# EAGLE design MotorSteuerung (EAGLE 9.4.2)
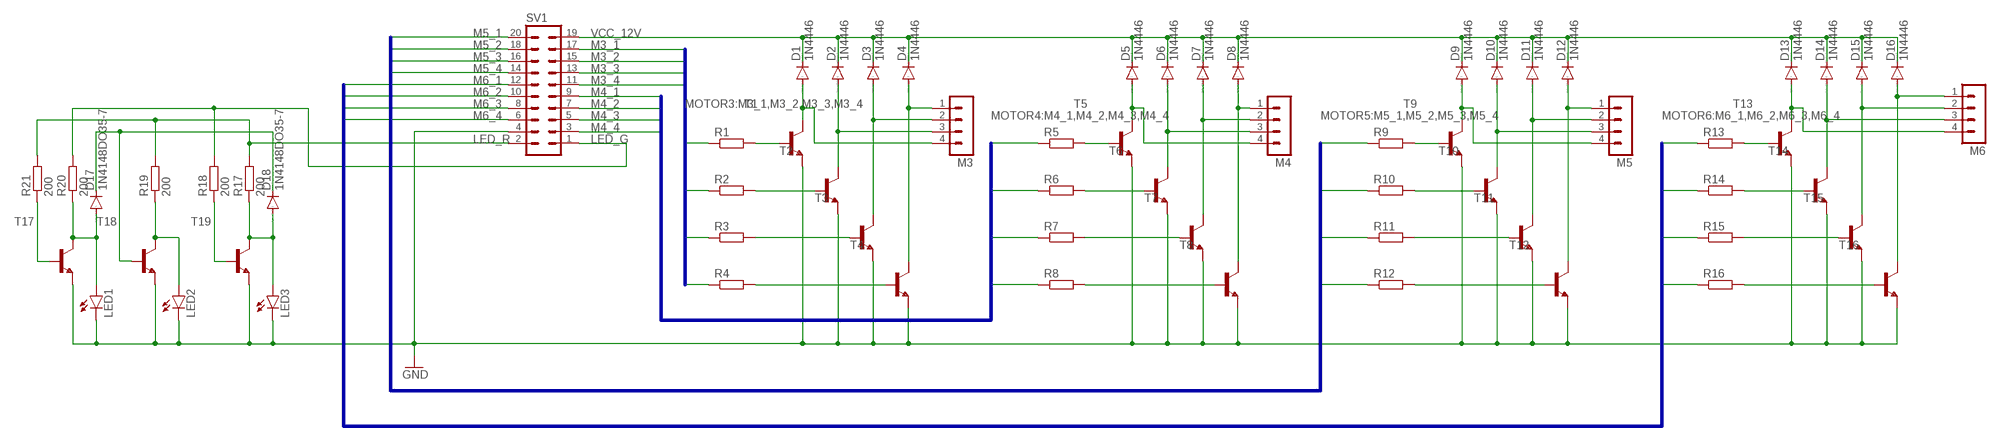
[diagram p0: schematic, sheet 1]

## Parts
D1  1N4446  [DO35-10]
D2  1N4446  [DO35-10]
D3  1N4446  [DO35-10]
D4  1N4446  [DO35-10]
D5  1N4446  [DO35-10]
D6  1N4446  [DO35-10]
D7  1N4446  [DO35-10]
D8  1N4446  [DO35-10]
D9  1N4446  [DO35-10]
D10  1N4446  [DO35-10]
D11  1N4446  [DO35-10]
D12  1N4446  [DO35-10]
D13  1N4446  [DO35-10]
D14  1N4446  [DO35-10]
D15  1N4446  [DO35-10]
D16  1N4446  [DO35-10]
D17  1N4148DO35-7  [DO35-7]
D18  1N4148DO35-7  [DO35-7]
LED1  LED3MM  [LED3MM]
LED2  LED3MM  [LED3MM]
LED3  LED3MM  [LED3MM]
M3  MA04-1  [MA04-1]
M4  MA04-1  [MA04-1]
M5  MA04-1  [MA04-1]
M6  MA04-1  [MA04-1]
R1  R-EU_0207/10  [0207/10]
R2  R-EU_0207/10  [0207/10]
R3  R-EU_0207/10  [0207/10]
R4  R-EU_0207/10  [0207/10]
R5  R-EU_0207/10  [0207/10]
R6  R-EU_0207/10  [0207/10]
R7  R-EU_0207/10  [0207/10]
R8  R-EU_0207/10  [0207/10]
R9  R-EU_0207/10  [0207/10]
R10  R-EU_0207/10  [0207/10]
R11  R-EU_0207/10  [0207/10]
R12  R-EU_0207/10  [0207/10]
R13  R-EU_0207/10  [0207/10]
R14  R-EU_0207/10  [0207/10]
R15  R-EU_0207/10  [0207/10]
R16  R-EU_0207/10  [0207/10]
R17  200  R-EU_0207/10  [0207/10]
R18  200  R-EU_0207/10  [0207/10]
R19  200  R-EU_0207/10  [0207/10]
R20  200  R-EU_0207/10  [0207/10]
R21  200  R-EU_0207/10  [0207/10]
SV1  MA10-2  [MA10-2]
T1  -NPN-TO126V  [TO126V]
T2  -NPN-TO126V  [TO126V]
T3  -NPN-TO126V  [TO126V]
T4  -NPN-TO126V  [TO126V]
T5  -NPN-TO126V  [TO126V]
T6  -NPN-TO126V  [TO126V]
T7  -NPN-TO126V  [TO126V]
T8  -NPN-TO126V  [TO126V]
T9  -NPN-TO126V  [TO126V]
T10  -NPN-TO126V  [TO126V]
T11  -NPN-TO126V  [TO126V]
T12  -NPN-TO126V  [TO126V]
T13  -NPN-TO126V  [TO126V]
T14  -NPN-TO126V  [TO126V]
T15  -NPN-TO126V  [TO126V]
T16  -NPN-TO126V  [TO126V]
T17  -NPN-TO92  [TO92]
T18  -NPN-TO92  [TO92]
T19  -NPN-TO92  [TO92]

## Nets
GND: LED1.K(C) LED2.K(C) LED3.K(C) SV1.4 T1.1(E) T2.1(E) T3.1(E) T4.1(E) T5.1(E) T6.1(E) T7.1(E) T8.1(E) T9.1(E) T10.1(E) T11.1(E) T12.1(E) T13.1(E) T14.1(E) T15.1(E) T16.1(E) T17.1(E) T18.1(E) T19.1(E)
LED_G: R18.2 R20.2 SV1.1
LED_R: R17.2 R19.2 R21.2 SV1.2
M3_1: R1.1 SV1.17
M3_2: R2.1 SV1.15
M3_3: R3.1 SV1.13
M3_4: R4.1 SV1.11
M4_1: R5.1 SV1.9
M4_2: R6.1 SV1.7
M4_3: R7.1 SV1.5
M4_4: R8.1 SV1.3
M5_1: R9.1 SV1.20
M5_2: R10.1 SV1.18
M5_3: R11.1 SV1.16
M5_4: R12.1 SV1.14
M6_1: R13.1 SV1.12
M6_2: R14.1 SV1.10
M6_3: R15.1 SV1.8
M6_4: R16.1 SV1.6
N$1: D1.A M3.4 T1.2(C)
N$2: D2.A M3.3 T2.2(C)
N$3: D3.A M3.2 T3.2(C)
N$4: D4.A M3.1 T4.2(C)
N$5: R1.2 T1.3(B)
N$6: R2.2 T2.3(B)
N$7: R3.2 T3.3(B)
N$8: R4.2 T4.3(B)
N$9: D5.A M4.4 T5.2(C)
N$10: D6.A M4.3 T6.2(C)
N$11: D7.A M4.2 T7.2(C)
N$12: D8.A M4.1 T8.2(C)
N$13: R5.2 T5.3(B)
N$14: R6.2 T6.3(B)
N$15: R7.2 T7.3(B)
N$16: R8.2 T8.3(B)
N$17: D9.A M5.4 T9.2(C)
N$18: D10.A M5.3 T10.2(C)
N$19: D11.A M5.2 T11.2(C)
N$20: D12.A M5.1 T12.2(C)
N$21: R9.2 T9.3(B)
N$22: R10.2 T10.3(B)
N$23: R11.2 T11.3(B)
N$24: R12.2 T12.3(B)
N$25: D13.A M6.4 T13.2(C)
N$26: D14.A M6.3 T14.2(C)
N$27: D15.A M6.2 T15.2(C)
N$28: D16.A M6.1 T16.2(C)
N$29: R13.2 T13.3(B)
N$30: R14.2 T14.3(B)
N$31: R15.2 T15.3(B)
N$32: R16.2 T16.3(B)
N$33: D18.A LED3.A R17.1 T19.3(C)
N$34: LED2.A R19.1 T18.3(C)
N$35: D17.A LED1.A R20.1 T17.3(C)
N$36: D17.C D18.C T18.2(B)
N$38: R21.1 T17.2(B)
N$39: R18.1 T19.2(B)
VCC_12V: D1.C D2.C D3.C D4.C D5.C D6.C D7.C D8.C D9.C D10.C D11.C D12.C D13.C D14.C D15.C D16.C SV1.19

## Buses
MOTOR3:M3_1,M3_2,M3_3,M3_4
MOTOR4:M4_1,M4_2,M4_3,M4_4
MOTOR5:M5_1,M5_2,M5_3,M5_4
MOTOR6:M6_1,M6_2,M6_3,M6_4

## Library data of the parts
D1-D16 = diode:1N4446: DIODE high speed (Philips)
D17 D18 = diode:1N4148: DIODE high speed (Philips)
LED1-LED3 = led:LED: LED OSRAM: - CHIPLED LG R971, LG N971, LY N971, LG Q971, LY Q971, LO R971, LY R971 LH N974, LH R974 LS Q976, LO Q976, LY Q976 LO Q996 - Hyper CHIPLED LW Q18S LB Q993, LB Q99A, LB R99A - SideLED LS A670, LO A670, LY A670, LG A670, LP A670 LB A673, LV A673, LT A673, LW A673 LH A674 LY A675 LS A676, LA A676, LO A676, LY A676, LW A676 LS A679, LY A679, LG A679 - Hyper Micro SIDELED® LS Y876, LA Y876, LO Y876, LY Y876 LT Y87S - SmartLED LW L88C, LW L88S LB L89C, LB L89S, LG L890 LS L89K, LO L89K, LY L89K LS L896, LA L896, LO L896, LY L896 - TOPLED LS T670, LO T670, LY T670, LG T670, LP T670 LSG T670, LSP T670, LSY T670, LOP T670, LYG T670 LG T671, LOG T671, LSG T671 LB T673, LV T673, LT T673, LW T673 LH T674 LS T676, LA T676, LO T676, LY T676, LB T676, LH T676, LSB T676, LW T676 LB T67C, LV T67C, LT T67C, LS T67K, LO T67K, LY T67K, LW E67C LS E67B, LA E67B, LO E67B, LY E67B, LB E67C, LV E67C, LT E67C LW T67C LS T679, LY T679, LG T679 LS T770, LO T770, LY T770, LG T770, LP T770 LB T773, LV T773, LT T773, LW T773 LH T774 LS E675, LA E675, LY E675, LS T675 LS T776, LA T776, LO T776, LY T776, LB T776 LHGB T686 LT T68C, LB T68C - Hyper Mini TOPLED® LB M676 - Mini TOPLED Santana® LG M470 LS M47K, LO M47K, LY M47K Source: http://www.osram.convergy.de LUXEON: - LUMILED® LXK2-PW12-R00, LXK2-PW12-S00, LXK2-PW14-U00, LXK2-PW14-V00 LXK2-PM12-R00, LXK2-PM12-S00, LXK2-PM14-U00 LXK2-PE12-Q00, LXK2-PE12-R00, LXK2-PE12-S00, LXK2-PE14-T00, LXK2-PE14-U00 LXK2-PB12-K00, LXK2-PB12-L00, LXK2-PB12-M00, LXK2-PB14-N00, LXK2-PB14-P00, LXK2-PB14-Q00 LXK2-PR12-L00, LXK2-PR12-M00, LXK2-PR14-Q00, LXK2-PR14-R00 LXK2-PD12-Q00, LXK2-PD12-R00, LXK2-PD12-S00 LXK2-PH12-R00, LXK2-PH12-S00 LXK2-PL12-P00, LXK2-PL12-Q00, LXK2-PL12-R00 Source: www.luxeon.com KINGBRIGHT: KA-3528ASYC Source: www.kingbright.com
M3-M6 = con-lstb:MA04-1: PIN HEADER; OC_FARNELL: unknown; OC_NEWARK: unknown
R1-R21 = rcl:R-EU_: RESISTOR, European symbol; SPICEPREFIX: R
SV1 = con-lstb:MA10-2: PIN HEADER; OC_FARNELL: unknown; OC_NEWARK: unknown
T1-T19 = transistor:*-NPN-: NPN Transistror BF959 corrected 2008.03.06

## Board
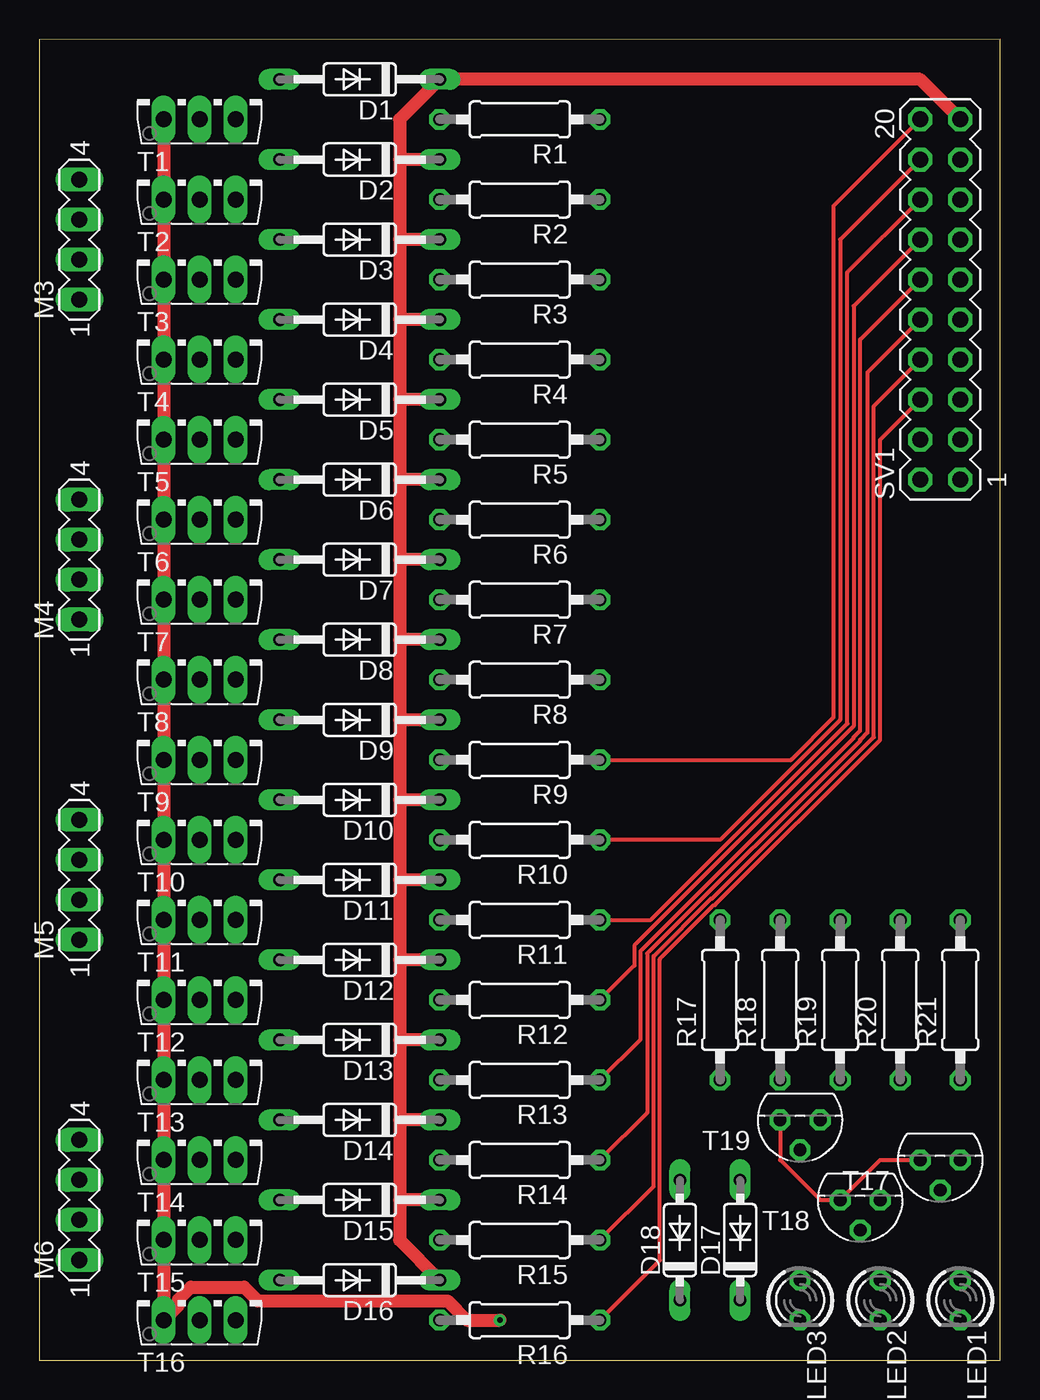
[diagram p1: board, top side]
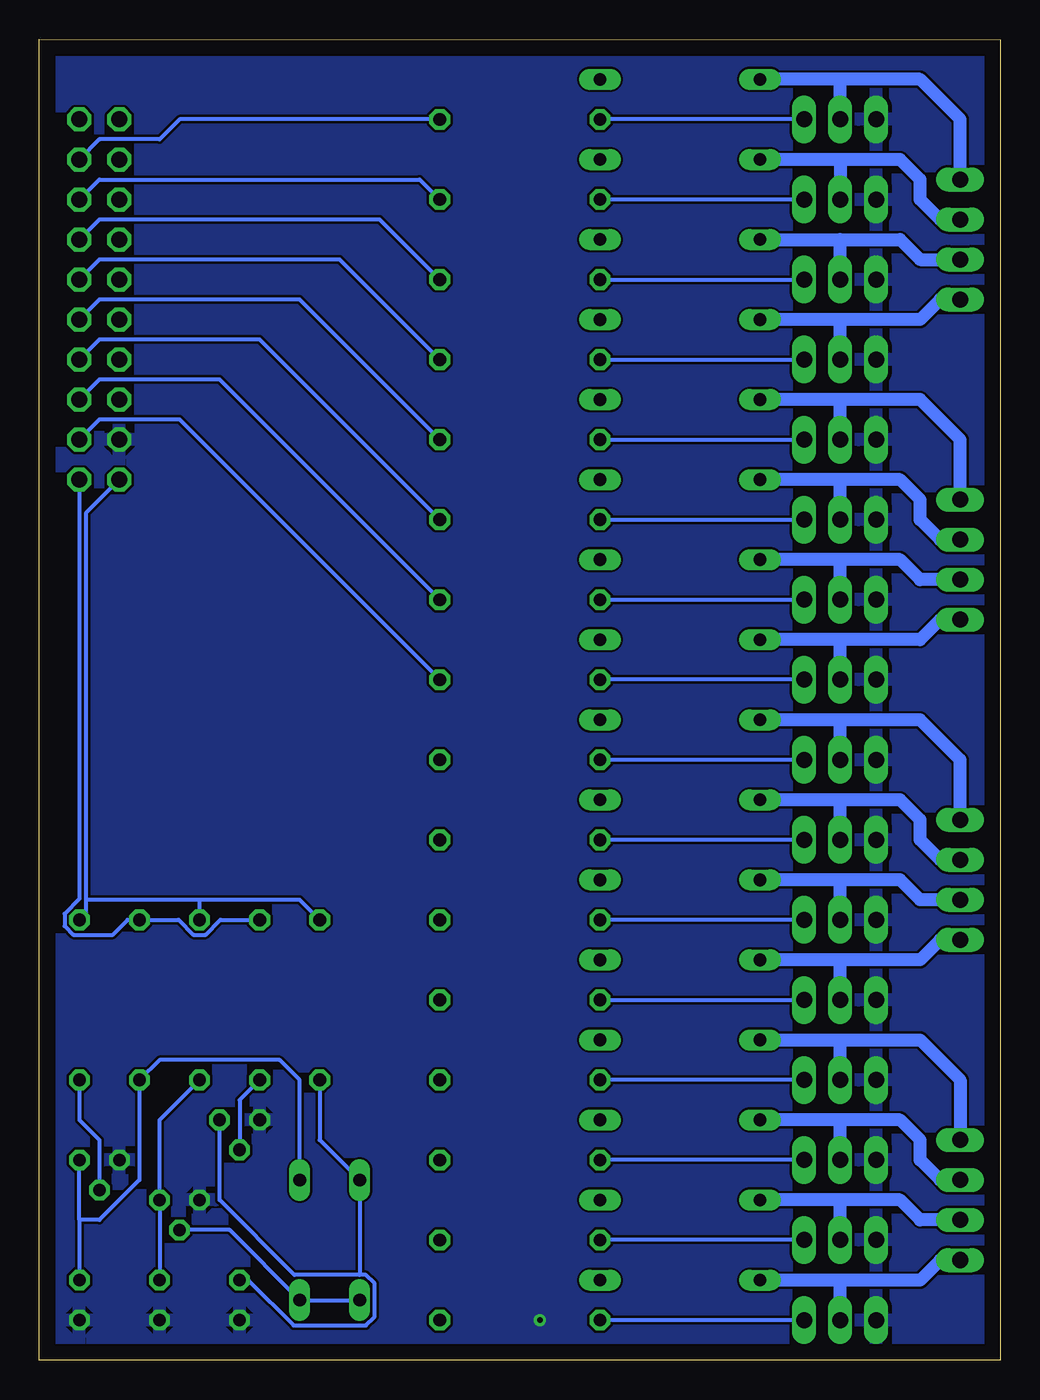
[diagram p2: board, bottom side, seen from below]

Size 60.96 x 83.82 mm. Coordinates in mm from the lower left corner, seen from the top.
Outline: 0,0 60.96,0 60.96,83.82 0,83.81 0,0
Copper layers (1*16): Top 0.035mm / dielectric 1.5mm / Bottom 0.035mm
Design rules "default": minimum track width 6mil, minimum drill 0.35mm, track to track 6mil, track to pad 6mil, pad to pad 6mil, via to via 6mil, smd to smd 6mil, copper to edge 40mil, drill to drill 6mil, minimum pad ring 10mil, minimum via ring 8mil, stop-mask expansion 4mil, vias tented up to drill 0mil, thermal gap 10mil

### Footprints (pad centres in the part's own frame; a part is rotated, then mirrored left to right if it is on the bottom)
DO35-10 = drill 0.813 long: A 5.08,0; C -5.08,0
DO35-7 = drill 0.813 long: A 3.81,0; C -3.81,0
LED3MM = drill 0.813 octagon: A -1.27,0; K 1.27,0
MA04-1 = drill 1.016 long: 1 -3.81,0; 2 -1.27,0; 3 1.27,0; 4 3.81,0
0207/10 = drill 0.813 octagon: 1 -5.08,0; 2 5.08,0
MA10-2 = drill 1.016 octagon: 1 -11.43,-1.27; 2 -11.43,1.27; 3 -8.89,-1.27; 4 -8.89,1.27; 5 -6.35,-1.27; 6 -6.35,1.27; 7 -3.81,-1.27; 8 -3.81,1.27; 9 -1.27,-1.27; 10 -1.27,1.27; 11 1.27,-1.27; 12 1.27,1.27; 13 3.81,-1.27; 14 3.81,1.27; 15 6.35,-1.27; 16 6.35,1.27; 17 8.89,-1.27; 18 8.89,1.27; 19 11.43,-1.27; 20 11.43,1.27
TO126V = drill 1.016 long: 1 -2.286,-1.27; 2 0,-1.27; 3 2.286,-1.27
TO92 = drill 0.813 octagon: 1 1.27,0; 2 0,1.905; 3 -1.27,0

### Placement (x,y rotation side)
D1  20.32,81.28 180 top
D2  20.32,76.2 180 top
D3  20.32,71.12 180 top
D4  20.32,66.04 180 top
D5  20.32,60.96 180 top
D6  20.32,55.88 180 top
D7  20.32,50.8 180 top
D8  20.32,45.72 180 top
D9  20.32,40.64 180 top
D10  20.32,35.56 180 top
D11  20.32,30.48 180 top
D12  20.32,25.4 180 top
D13  20.32,20.32 180 top
D14  20.32,15.24 180 top
D15  20.32,10.16 180 top
D16  20.32,5.08 180 top
D17  44.45,7.62 90 top
D18  40.64,7.62 90 top
LED1  58.42,3.81 270 top
LED2  53.34,3.81 270 top
LED3  48.26,3.81 270 top
M3  2.54,71.12 90 top
M4  2.54,50.8 90 top
M5  2.54,30.48 90 top
M6  2.54,10.16 90 top
R1  30.48,78.74 180 top
R2  30.48,73.66 180 top
R3  30.48,68.58 180 top
R4  30.48,63.5 180 top
R5  30.48,58.42 180 top
R6  30.48,53.34 180 top
R7  30.48,48.26 180 top
R8  30.48,43.18 180 top
R9  30.48,38.1 180 top
R10  30.48,33.02 180 top
R11  30.48,27.94 180 top
R12  30.48,22.86 180 top
R13  30.48,17.78 180 top
R14  30.48,12.7 180 top
R15  30.48,7.62 180 top
R16  30.48,2.54 180 top
R17  43.18,22.86 90 top
R18  46.99,22.86 90 top
R19  50.8,22.86 90 top
R20  54.61,22.86 90 top
R21  58.42,22.86 90 top
SV1  57.15,67.31 90 top
T1  10.16,80.01 0 top
T2  10.16,74.93 0 top
T3  10.16,69.85 0 top
T4  10.16,64.77 0 top
T5  10.16,59.69 0 top
T6  10.16,54.61 0 top
T7  10.16,49.53 0 top
T8  10.16,44.45 0 top
T9  10.16,39.37 0 top
T10  10.16,34.29 0 top
T11  10.16,29.21 0 top
T12  10.16,24.13 0 top
T13  10.16,19.05 0 top
T14  10.16,13.97 0 top
T15  10.16,8.89 0 top
T16  10.16,3.81 0 top
T17  57.15,12.7 180 top
T18  52.07,10.16 180 top
T19  48.26,15.24 180 top

### Tracks (layer width: path | path; a pad name or v marks a point on that pad's centre or on a via)
GND  (via drill 0.35)
  Top 0.254: T19.1 46.99,12.7 49.53,10.16 T18.1 53.34,12.7 T17.1 | T16.1 7.87,2.79
  Top 0.813: T1.1 T2.1 T3.1 T4.1 T5.1 T6.1 T7.1 T8.1 T9.1 T10.1 T11.1 T12.1 T13.1 T14.1 T15.1 7.87,2.79 7.62,2.54 | T16.1 8.84,3.5 8.84,3.85 9.61,4.62 12.99,4.62 13.86,3.76 25.91,3.76 27.12,2.54 v29.21,2.54
  pour Bottom: 1.27,1.27 59.69,1.27 59.69,82.55 1.27,82.55
LED_G
  Bottom 0.254: R18.2 49.47,27.94 50.41,27 51.19,27 52.13,27.94 R20.2 55.36,27.94 56.3,27 58.81,27 59.36,27.55 59.36,28.33 58.42,29.27 SV1.1
LED_R
  Bottom 0.254: SV1.2 58.01,53.75 58.01,29.21 | R21.2 58.01,28.35 58.01,29.21 | R17.2 44.45,29.21 50.8,29.21 | 50.8,29.21 58.01,29.21 | R19.2 50.8,29.21
M3_1
  Bottom 0.254: R1.1 52.07,78.74 53.34,77.47 57.15,77.47 SV1.17
M3_2
  Bottom 0.254: SV1.15 57.15,74.93 36.83,74.93 R2.1
M3_3
  Bottom 0.254: R3.1 39.37,72.39 57.15,72.39 SV1.13
M3_4
  Bottom 0.254: R4.1 41.91,69.85 57.15,69.85 SV1.11
M4_1
  Bottom 0.254: R5.1 44.45,67.31 57.15,67.31 SV1.9
M4_2
  Bottom 0.254: R6.1 46.99,64.77 57.15,64.77 SV1.7
M4_3
  Bottom 0.254: R7.1 49.53,62.23 57.15,62.23 SV1.5
M4_4
  Bottom 0.254: R8.1 52.07,59.69 57.15,59.69 SV1.3
M5_1
  Top 0.254: R9.1 47.69,38.1 50.39,40.81 50.39,73.25 SV1.20
M5_2
  Top 0.254: SV1.18 50.8,71.12 50.8,40.64 43.18,33.02 R10.1
M5_3
  Top 0.254: R11.1 38.8,27.94 51.26,40.4 51.26,69.04 SV1.16
M5_4
  Top 0.254: SV1.14 51.66,66.9 51.66,40.23 37.74,26.31 37.74,25.04 R12.1
M6_1
  Top 0.254: R13.1 38.15,20.37 38.15,25.96 51.66,39.48 51.66,39.54 52.07,39.95 52.07,64.77 SV1.12
M6_2
  Top 0.254: R14.1 38.56,15.7 38.56,25.8 52.07,39.31 52.07,39.37 52.53,39.83 52.53,60.96 52.53,61.62 52.53,62.69 SV1.10
M6_3
  Top 0.254: R15.1 38.96,11.02 38.96,25.63 42.62,29.29 42.68,29.29 52.93,39.54 52.93,60.55 SV1.8
M6_4
  Top 0.254: R16.1 39.37,6.35 39.37,25.46 42.79,28.88 42.85,28.88 53.34,39.37 53.34,58.42 SV1.6
N$1
  Bottom 0.813: M3.4 2.54,78.74 5.08,81.28 10.16,81.28 | 10.16,81.28 D1.A | T1.2 10.16,81.28
N$2
  Bottom 0.813: 10.16,76.2 D2.A | 10.16,76.2 T2.2 | M3.3 3.81,72.39 5.08,73.66 5.08,74.93 6.35,76.2 10.16,76.2
N$3
  Bottom 0.813: D3.A 10.16,71.12 | 10.16,71.12 6.35,71.12 5.08,69.85 M3.2 | T3.2 10.16,71.12
N$4
  Bottom 0.813: M3.1 3.81,67.31 5.08,66.04 10.16,66.04 | 10.16,66.04 D4.A | T4.2 10.16,66.04
N$5
  Bottom 0.254: T1.3 R1.2
N$6
  Bottom 0.254: T2.3 R2.2
N$7
  Bottom 0.254: R3.2 T3.3
N$8
  Bottom 0.254: R4.2 T4.3
N$9
  Bottom 0.813: M4.4 2.54,58.42 5.08,60.96 10.16,60.96 | 10.16,60.96 D5.A | T5.2 10.16,60.96
N$10
  Bottom 0.813: M4.3 3.81,52.07 5.08,53.34 5.08,54.61 6.35,55.88 10.16,55.88 | 10.16,55.88 D6.A | T6.2 10.16,55.88
N$11
  Bottom 0.813: M4.2 5.08,49.53 6.35,50.8 10.16,50.8 | 10.16,50.8 D7.A | T7.2 10.16,50.8
N$12
  Bottom 0.813: M4.1 3.81,46.99 5.08,45.72 10.16,45.72 | 10.16,45.72 D8.A | T8.2 10.16,45.72
N$13
  Bottom 0.254: R5.2 T5.3
N$14
  Bottom 0.254: R6.2 T6.3
N$15
  Bottom 0.254: R7.2 T7.3
N$16
  Bottom 0.254: T8.3 R8.2
N$17
  Bottom 0.813: M5.4 2.54,38.1 5.08,40.64 10.16,40.64 | 10.16,40.64 D9.A | T9.2 10.16,40.64
N$18
  Bottom 0.813: M5.3 3.81,31.75 5.08,33.02 5.08,34.29 6.35,35.56 10.16,35.56 | 10.16,35.56 D10.A | T10.2 10.16,35.56
N$19
  Bottom 0.813: M5.2 5.08,29.21 6.35,30.48 10.16,30.48 | 10.16,30.48 D11.A | T11.2 10.16,30.48
N$20
  Bottom 0.813: M5.1 3.81,26.67 5.08,25.4 10.16,25.4 | 10.16,25.4 D12.A | T12.2 10.16,25.4
N$21
  Bottom 0.254: T9.3 R9.2
N$22
  Bottom 0.254: T10.3 R10.2
N$23
  Bottom 0.254: T11.3 R11.2
N$24
  Bottom 0.254: R12.2 T12.3
N$25
  Bottom 0.813: M6.4 2.54,17.78 5.08,20.32 10.16,20.32 | D13.A 10.16,20.32 | T13.2 10.16,20.32
N$26
  Bottom 0.813: M6.3 3.81,11.43 5.08,12.7 5.08,13.97 6.35,15.24 10.16,15.24 | 10.16,15.24 D14.A | T14.2 10.16,15.24
N$27
  Bottom 0.813: M6.2 5.08,8.89 6.35,10.16 10.16,10.16 | 10.16,10.16 D15.A | T15.2 10.16,10.16
N$28
  Bottom 0.813: M6.1 3.81,6.35 5.08,5.08 10.16,5.08 | 10.16,5.08 D16.A | T16.2 10.16,5.08
N$29
  Bottom 0.254: T13.3 R13.2
N$30
  Bottom 0.254: T14.3 R14.2
N$31
  Bottom 0.254: T15.3 R15.2
N$32
  Bottom 0.254: T16.3 R16.2
N$33
  Bottom 0.254: LED3.A 47.71,5.08 44.84,2.21 40.25,2.21 39.7,2.76 39.7,4.86 40.25,5.41 40.64,5.41 | 40.64,5.41 44.78,5.41 49.53,10.16 T19.3 | 40.64,5.41 D18.A 43.18,13.97 R17.1
N$34
  Bottom 0.254: LED2.A T18.3 53.34,15.24 R19.1
N$35
  Bottom 0.254: 58.42,8.89 57.15,8.89 54.61,11.43 R20.1 53.34,19.05 45.72,19.05 44.45,17.78 D17.A | 58.42,8.89 T17.3 | 58.42,8.89 LED1.A
N$36
  Bottom 0.254: D18.C D17.C 48.9,8.26 T18.2
N$38
  Bottom 0.254: R21.1 58.42,15.24 57.15,13.97 T17.2
N$39
  Bottom 0.254: R18.1 48.26,16.51 T19.2
VCC_12V
  Top 0.813: SV1.19 55.88,81.28 D1.C 22.86,78.74 22.86,76.2 | 22.86,76.2 22.86,71.12 | 22.86,71.12 22.86,66.04 | 22.86,66.04 22.86,60.96 | 22.86,60.96 22.86,55.88 | 22.86,55.88 22.86,50.8 | 22.86,50.8 22.86,45.72 | 22.86,45.72 22.86,40.64 | 22.86,40.64 22.86,35.56 | 22.86,35.56 22.86,30.48 | 22.86,30.48 22.86,25.4 | 22.86,25.4 22.86,20.32 | 22.86,20.32 22.86,15.24 | 22.86,15.24 22.86,10.16 | 22.86,10.16 22.86,7.62 D16.C | D15.C 22.86,10.16 | D14.C 22.86,15.24 | D13.C 22.86,20.32 | D12.C 22.86,25.4 | D11.C 22.86,30.48 | D10.C 22.86,35.56 | D9.C 22.86,40.64 | D8.C 22.86,45.72 | D7.C 22.86,50.8 | D6.C 22.86,55.88 | D5.C 22.86,60.96 | D4.C 22.86,66.04 | D3.C 22.86,71.12 | D2.C 22.86,76.2